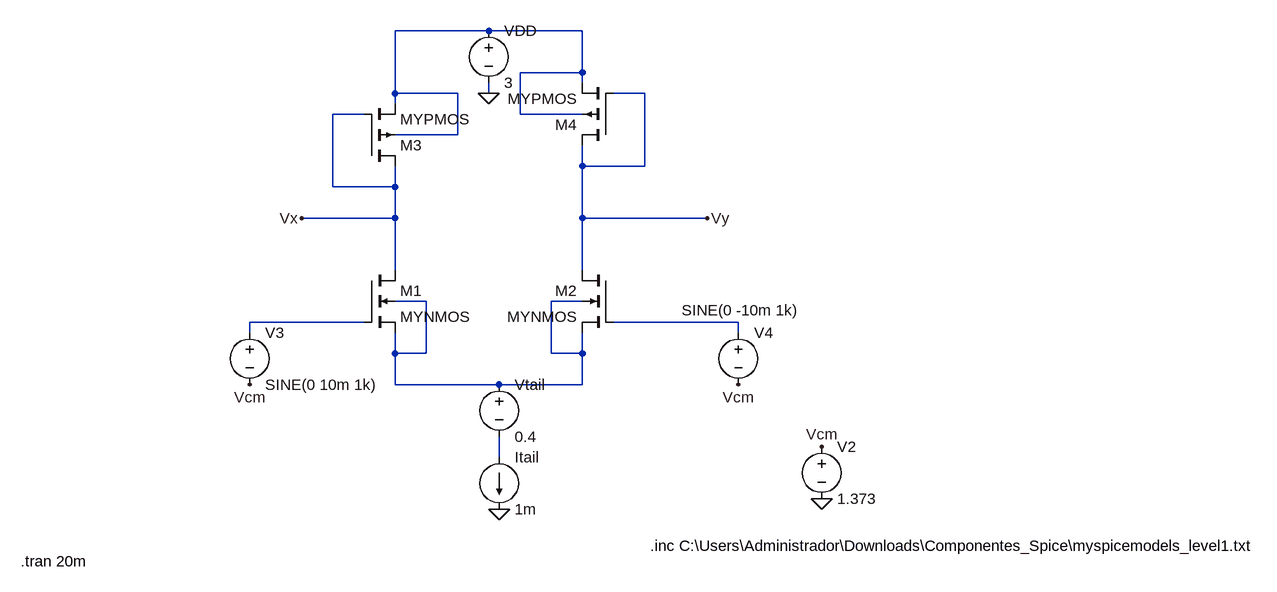
[diagram p0: schematic PMOS_como_diodo.asc]
PMOS_como_diodo.asc, the LTspice schematic file:
Version 4
SHEET 1 1960 680
WIRE 160 -448 16 -448
WIRE 304 -448 160 -448
WIRE 304 -384 304 -448
WIRE 304 -384 208 -384
WIRE 304 -368 304 -384
WIRE 16 -352 16 -448
WIRE 112 -352 16 -352
WIRE 160 -352 160 -368
WIRE 400 -352 352 -352
WIRE 16 -336 16 -352
WIRE -32 -320 -80 -320
WIRE 208 -320 208 -384
WIRE 304 -320 208 -320
WIRE 112 -288 112 -352
WIRE 112 -288 16 -288
WIRE 304 -240 304 -272
WIRE 400 -240 400 -352
WIRE 400 -240 304 -240
WIRE -80 -208 -80 -320
WIRE 16 -208 16 -240
WIRE 16 -208 -80 -208
WIRE 16 -160 16 -208
WIRE 16 -160 -128 -160
WIRE 304 -160 304 -240
WIRE 496 -160 304 -160
WIRE 16 -80 16 -160
WIRE 304 -80 304 -160
WIRE 64 -32 16 -32
WIRE 304 -32 256 -32
WIRE -32 0 -208 0
WIRE 544 0 352 0
WIRE -208 16 -208 0
WIRE 544 16 544 0
WIRE 16 48 16 16
WIRE 64 48 64 -32
WIRE 64 48 16 48
WIRE 256 48 256 -32
WIRE 304 48 304 16
WIRE 304 48 256 48
WIRE 16 96 16 48
WIRE 176 96 16 96
WIRE 304 96 304 48
WIRE 304 96 176 96
WIRE 176 208 176 176
FLAG 176 288 0
FLAG 160 -352 0
FLAG 496 -160 Vy
FLAG -128 -160 Vx
FLAG 672 192 Vcm
FLAG 672 272 0
FLAG -208 96 Vcm
FLAG 544 96 Vcm
SYMBOL current 176 208 R0
WINDOW 123 0 0 Left 0
WINDOW 39 0 0 Left 0
SYMATTR InstName Itail
SYMATTR Value 1m
SYMBOL voltage 176 80 R0
WINDOW 123 0 0 Left 0
WINDOW 39 0 0 Left 0
SYMATTR InstName Vtail
SYMATTR Value 0.4
SYMBOL nmos4 -32 -80 R0
SYMATTR InstName M1
SYMATTR Value MYNMOS
SYMATTR Value2 l=0.5u w=50u
SYMBOL nmos4 352 -80 M0
SYMATTR InstName M2
SYMATTR Value MYNMOS
SYMATTR Value2 l=0.5u w=50u
SYMBOL voltage 160 -464 R0
WINDOW 123 0 0 Left 0
WINDOW 39 0 0 Left 0
SYMATTR InstName VDD
SYMATTR Value 3
SYMBOL voltage 672 176 R0
WINDOW 123 0 0 Left 0
WINDOW 39 0 0 Left 0
SYMATTR InstName V2
SYMATTR Value 1.373
SYMBOL voltage -208 0 R0
WINDOW 123 0 0 Left 0
WINDOW 39 0 0 Left 0
SYMATTR InstName V3
SYMATTR Value SINE(0 10m 1k)
SYMBOL voltage 544 0 R0
WINDOW 3 -87 -18 Left 2
WINDOW 123 0 0 Left 0
WINDOW 39 0 0 Left 0
SYMATTR Value SINE(0 -10m 1k)
SYMATTR InstName V4
SYMBOL pmos4 -32 -240 M180
SYMATTR InstName M3
SYMATTR Value MYPMOS
SYMATTR Value2 l=1u w=50u
SYMBOL pmos4 352 -272 R180
SYMATTR InstName M4
SYMATTR Value MYPMOS
SYMATTR Value2 l=1u w=50u
TEXT 408 344 Left 2 !.inc C:\\Users\\Administrador\\Downloads\\Componentes_Spice\\myspicemodels_level1.txt
TEXT -560 368 Left 2 !.tran 20m

The netlist it stands for:
* PMOS_como_diodo.asc
Itail N005 0 1m
Vtail N002 N005 0.4
M1 Vx N003 N002 N002 MYNMOS l=0.5u w=50u
M2 Vy N004 N002 N002 MYNMOS l=0.5u w=50u
VDD N001 0 3
V2 Vcm 0 1.373
V3 N003 Vcm SINE(0 10m 1k)
V4 N004 Vcm SINE(0 -10m 1k)
M3 Vx Vx N001 N001 MYPMOS l=1u w=50u
M4 Vy Vy N001 N001 MYPMOS l=1u w=50u
.model NMOS NMOS
.model PMOS PMOS
.lib standard.mos
.inc C:\Users\Administrador\Downloads\Componentes_Spice\myspicemodels_level1.txt
.tran 20m
.backanno
.end